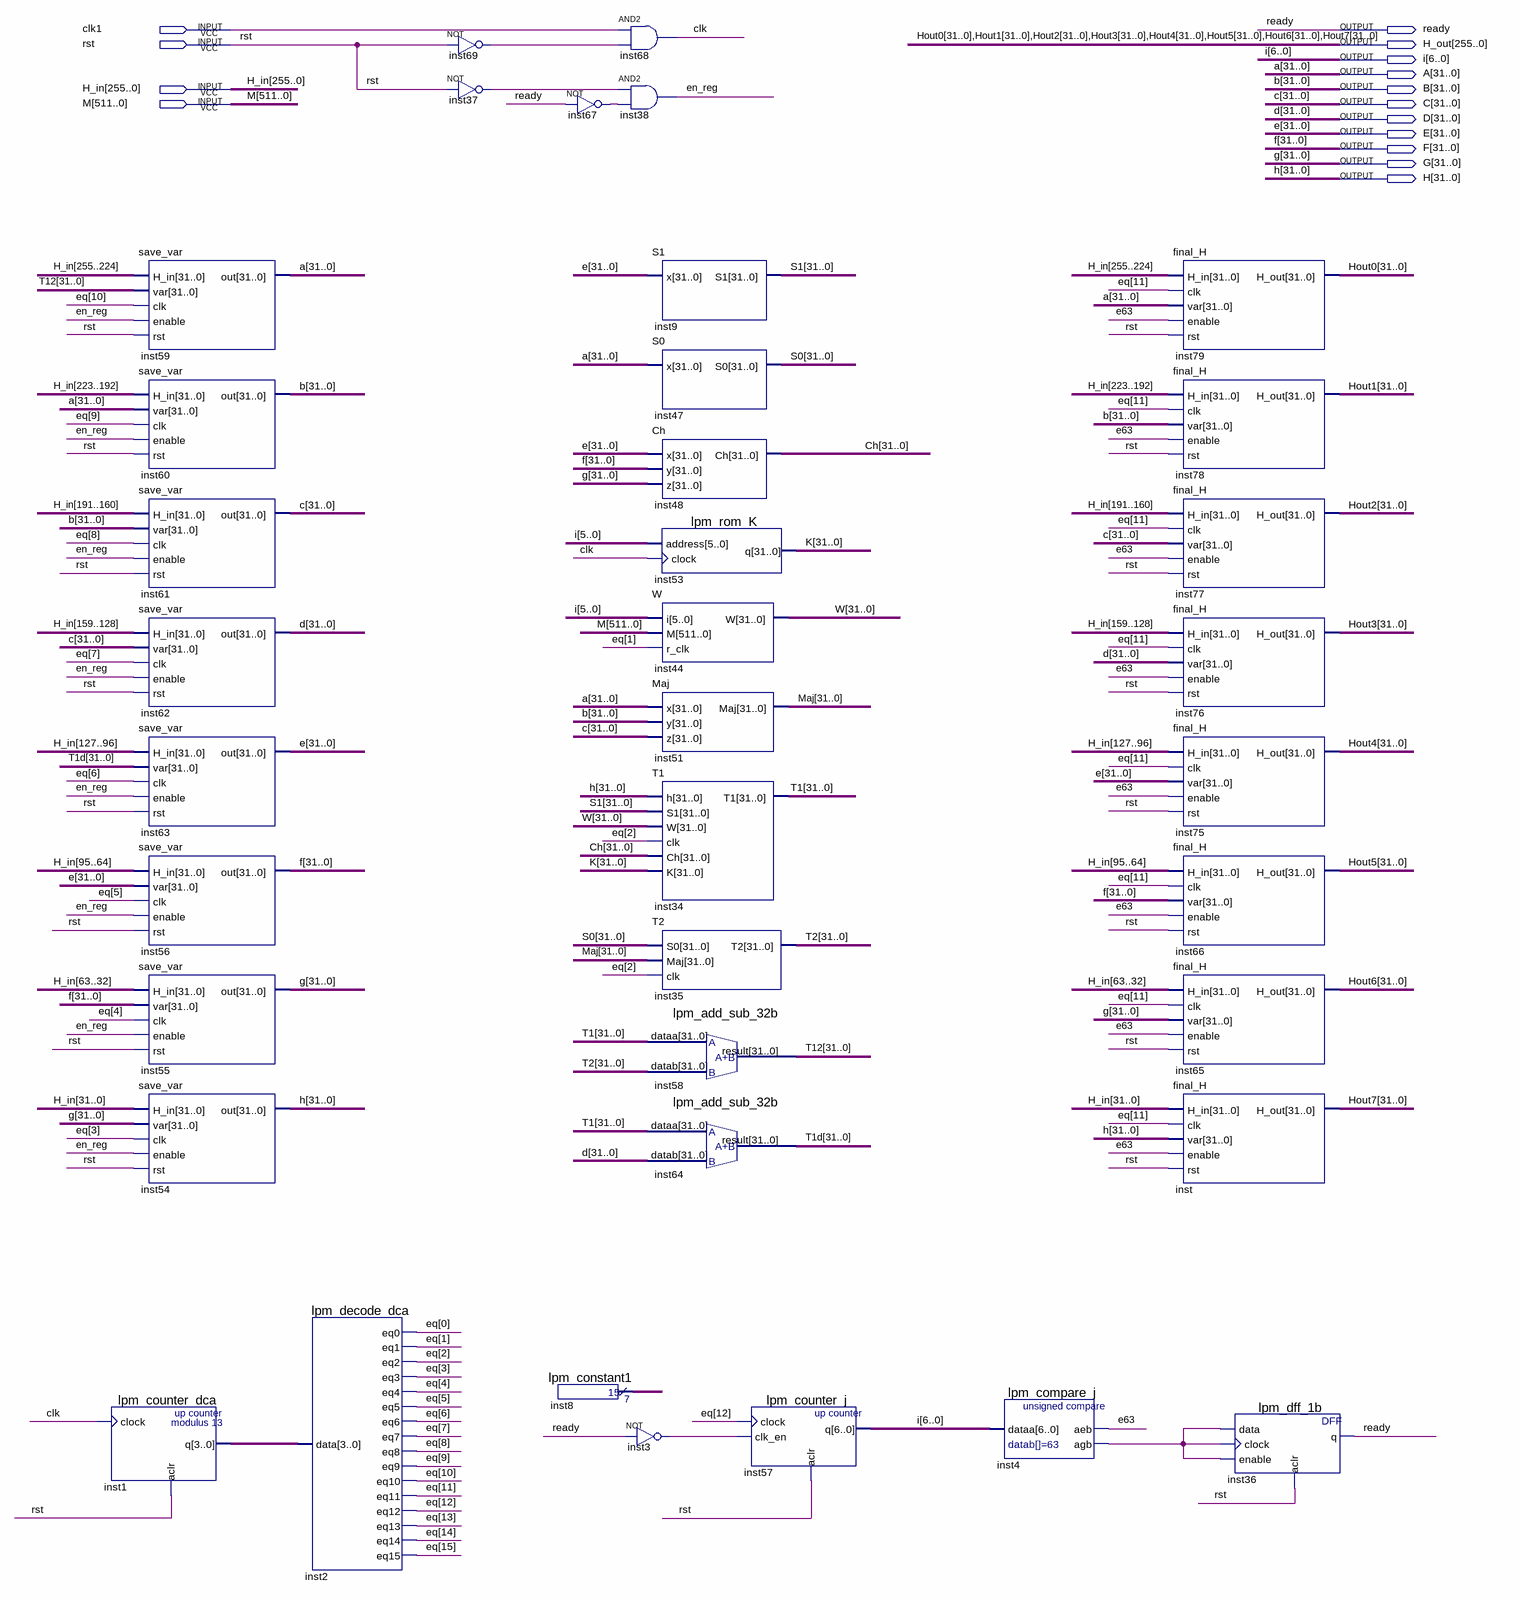
[diagram p0: schematic sheet]
// Quartus schematic SHA256.bdf as structural Verilog: 38 symbols, 15 pins
module SHA256 (
  input  clk1,
  input  rst,
  input  [255:0] H_in,
  input  [511:0] M,
  output ready,
  output [255:0] H_out,
  output [6:0] i,
  output [31:0] A,
  output [31:0] B,
  output [31:0] C,
  output [31:0] D,
  output [31:0] E,
  output [31:0] F,
  output [31:0] G,
  output [31:0] H
);

  wire clk, e63, en_reg, inst3_out, inst4_agb, inst37_out, inst67_out, inst69_out;
  wire [3:0] inst1_q;
  wire [6:0] inst8_result;
  wire [15:0] eq;
  wire [31:0] Ch, K, Maj, S0, S1, T1, T1d, T2, T12, W;

  save_var inst59 (.H_in(H_in[255:224]), .\var (T12), .clk(eq[10]), .enable(en_reg), .rst(rst), .out(A));
  save_var inst60 (.H_in(H_in[223:192]), .\var (A), .clk(eq[9]), .enable(en_reg), .rst(rst), .out(B));
  save_var inst61 (.H_in(H_in[191:160]), .\var (B), .clk(eq[8]), .enable(en_reg), .rst(rst), .out(C));
  save_var inst62 (.H_in(H_in[159:128]), .\var (C), .clk(eq[7]), .enable(en_reg), .rst(rst), .out(D));
  save_var inst63 (.H_in(H_in[127:96]), .\var (T1d), .clk(eq[6]), .enable(en_reg), .rst(rst), .out(E));
  save_var inst56 (.H_in(H_in[95:64]), .\var (E), .clk(eq[5]), .enable(en_reg), .rst(rst), .out(F));
  save_var inst55 (.H_in(H_in[63:32]), .\var (F), .clk(eq[4]), .enable(en_reg), .rst(rst), .out(G));
  save_var inst54 (.H_in(H_in[31:0]), .\var (G), .clk(eq[3]), .enable(en_reg), .rst(rst), .out(H));
  lpm_counter_dca inst1 (.clock(clk), .aclr(rst), .q(inst1_q));
  lpm_decode_dca inst2 (
    .data(inst1_q), .eq0(eq[0]), .eq1(eq[1]), .eq2(eq[2]), .eq3(eq[3]), .eq4(eq[4]), .eq5(eq[5]),
    .eq6(eq[6]), .eq7(eq[7]), .eq8(eq[8]), .eq9(eq[9]), .eq10(eq[10]), .eq11(eq[11]), .eq12(eq[12]),
    .eq13(eq[13]), .eq14(eq[14]), .eq15(eq[15]));
  not inst69 (inst69_out, rst);
  not inst37 (inst37_out, rst);
  not inst67 (inst67_out, ready);
  lpm_constant1 inst8 (.result(inst8_result));
  and inst68 (clk, clk1, inst69_out);
  and inst38 (en_reg, inst37_out, inst67_out);
  not inst3 (inst3_out, ready);
  S1 inst9 (.x(E), .S1(S1));
  S0 inst47 (.x(A), .S0(S0));
  Ch inst48 (.x(E), .y(F), .z(G), .Ch(Ch));
  lpm_rom_K inst53 (.address(i[5:0]), .clock(clk), .q(K));
  W inst44 (.i(i[5:0]), .M(M), .r_clk(eq[1]), .W(W));
  Maj inst51 (.x(A), .y(B), .z(C), .Maj(Maj));
  T1 inst34 (.h(H), .S1(S1), .W(W), .clk(eq[2]), .Ch(Ch), .K(K), .T1(T1));
  T2 inst35 (.S0(S0), .Maj(Maj), .clk(eq[2]), .T2(T2));
  lpm_add_sub_32b inst58 (.dataa(T1), .datab(T2), .result(T12));
  lpm_add_sub_32b inst64 (.dataa(T1), .datab(D), .result(T1d));
  lpm_counter_j inst57 (.clock(eq[12]), .clk_en(inst3_out), .aclr(rst), .q(i));
  lpm_compare_j inst4 (.dataa(i), .aeb(e63), .agb(inst4_agb));
  final_H inst79 (.H_in(H_in[255:224]), .clk(eq[11]), .\var (A), .enable(e63), .rst(rst), .H_out(H_out[255:224]));
  final_H inst78 (.H_in(H_in[223:192]), .clk(eq[11]), .\var (B), .enable(e63), .rst(rst), .H_out(H_out[223:192]));
  final_H inst77 (.H_in(H_in[191:160]), .clk(eq[11]), .\var (C), .enable(e63), .rst(rst), .H_out(H_out[191:160]));
  final_H inst76 (.H_in(H_in[159:128]), .clk(eq[11]), .\var (D), .enable(e63), .rst(rst), .H_out(H_out[159:128]));
  final_H inst75 (.H_in(H_in[127:96]), .clk(eq[11]), .\var (E), .enable(e63), .rst(rst), .H_out(H_out[127:96]));
  final_H inst66 (.H_in(H_in[95:64]), .clk(eq[11]), .\var (F), .enable(e63), .rst(rst), .H_out(H_out[95:64]));
  final_H inst65 (.H_in(H_in[63:32]), .clk(eq[11]), .\var (G), .enable(e63), .rst(rst), .H_out(H_out[63:32]));
  final_H inst (.H_in(H_in[31:0]), .clk(eq[11]), .\var (H), .enable(e63), .rst(rst), .H_out(H_out[31:0]));
  lpm_dff_1b inst36 (.data(inst4_agb), .clock(inst4_agb), .enable(inst4_agb), .aclr(rst), .q(ready));

  // Other names for the same wires on the sheet: Hout0[31:0] = H_out[255:224]; Hout1[31:0] = H_out[223:192];
  //   Hout2[31:0] = H_out[191:160]; Hout3[31:0] = H_out[159:128]; Hout4[31:0] = H_out[127:96];
  //   Hout5[31:0] = H_out[95:64]; Hout6[31:0] = H_out[63:32]; Hout7[31:0] = H_out[31:0]
endmodule
